# EAGLE board altair (EAGLE 9.4.1), part 1 of 2
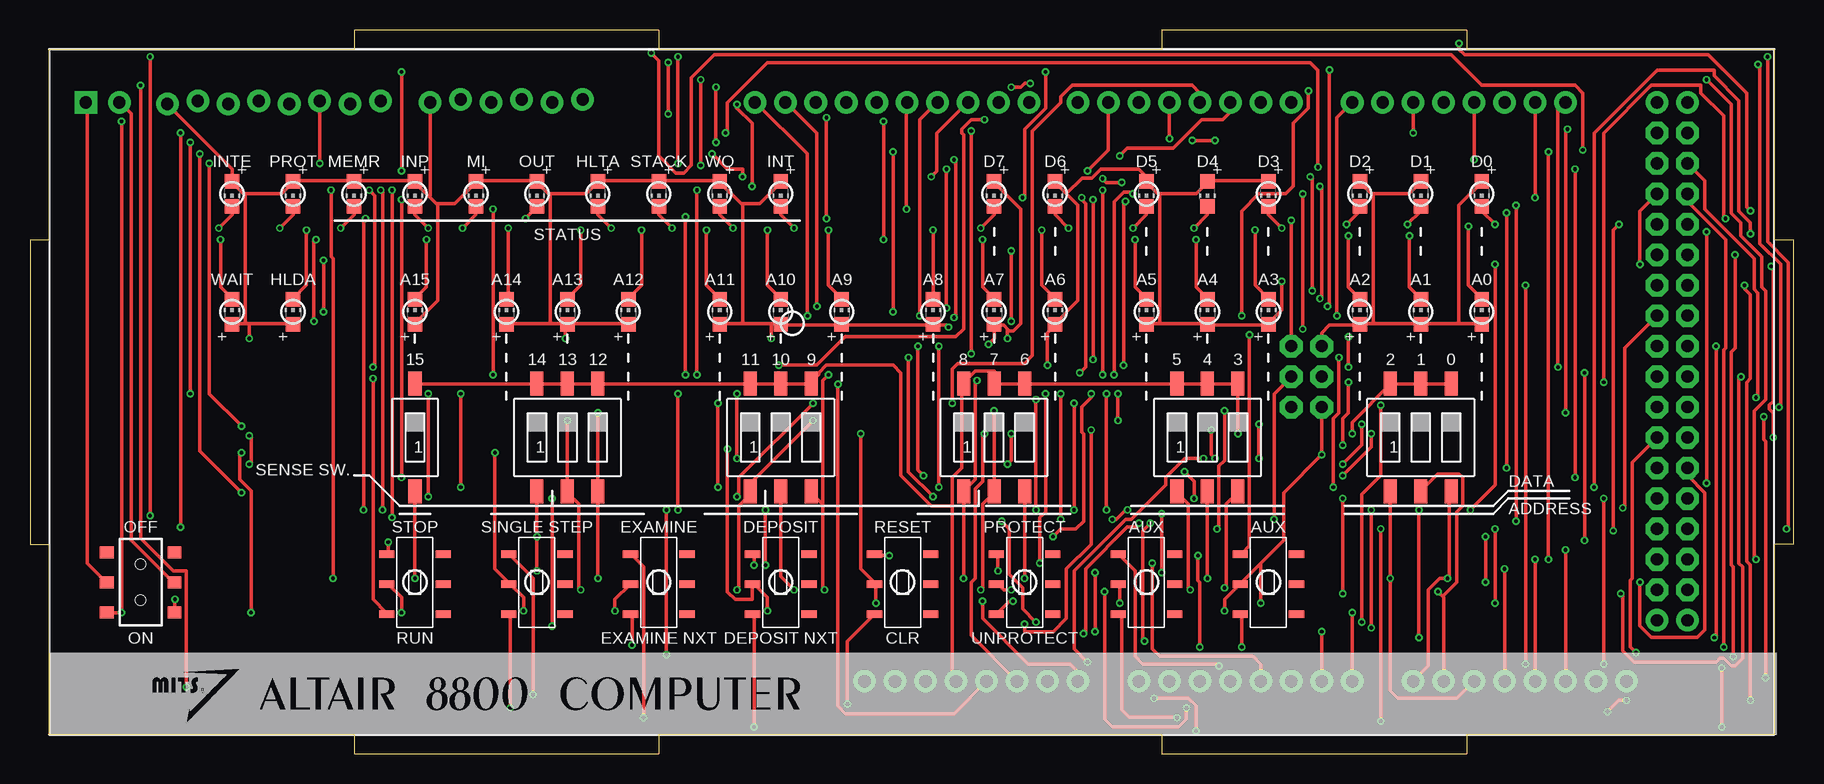
[diagram p2: board, top side]
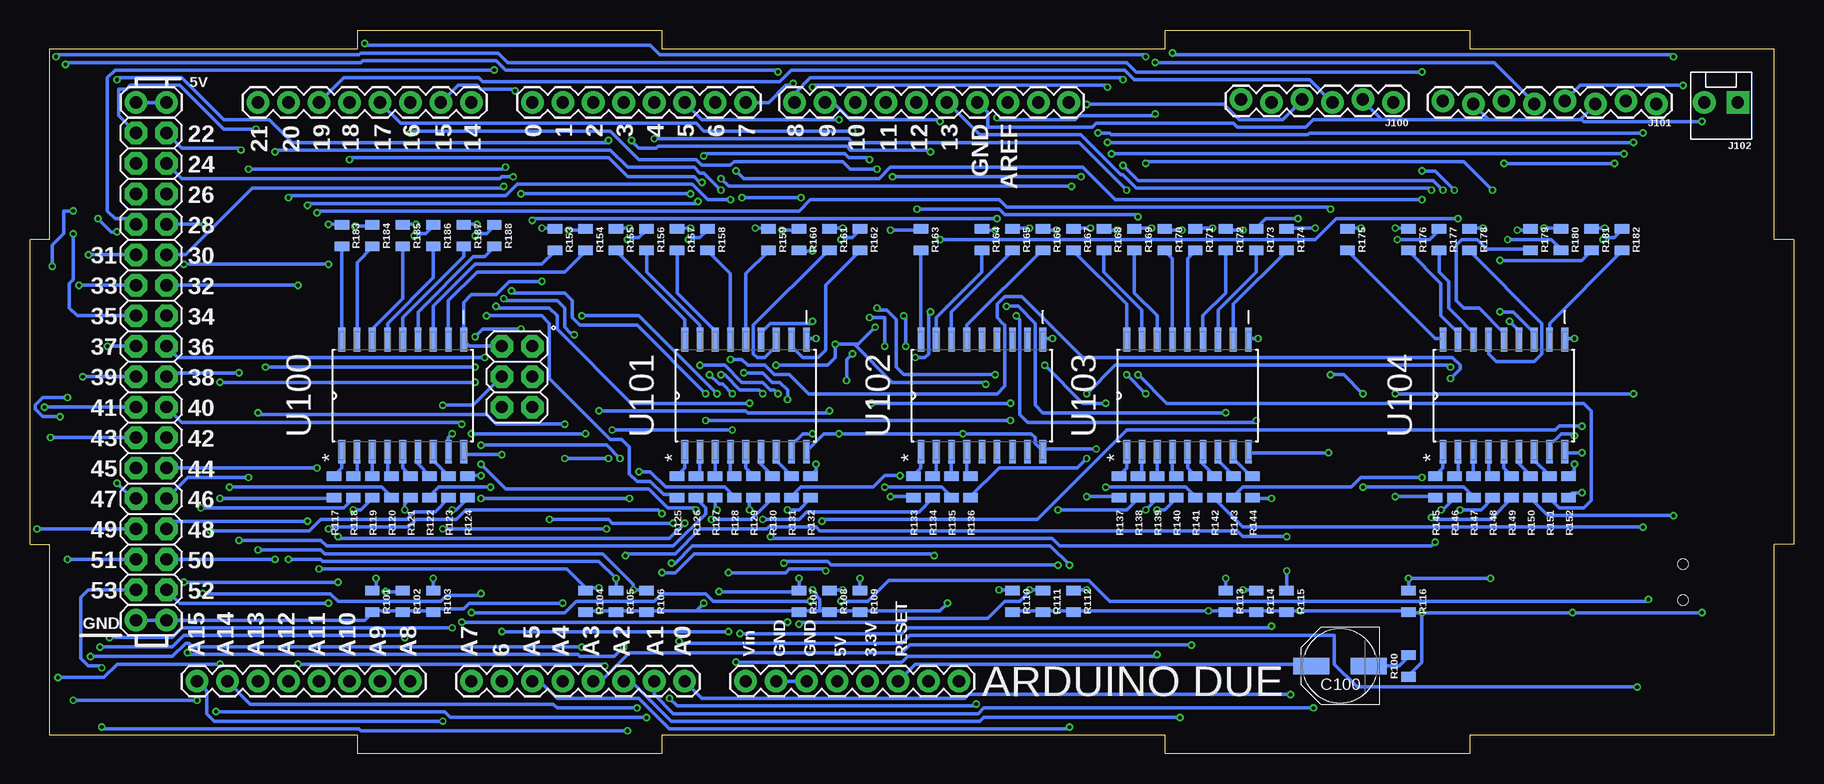
[diagram p3: board, bottom side, seen from below]

Size 146.96 x 60.35 mm. Coordinates in mm from the lower left corner, seen from the top.
Outline: 1.6,1.6 1.6,17.48 0,17.48 0,42.88 1.6,42.88 1.6,58.75 27,58.75 27,60.35 52.4,60.35 52.4,58.75 94.31,58.75 94.31,60.35 119.71,60.35 119.71,58.75 145.36,58.75 145.36,42.88 146.96,42.88 146.96,17.48 145.36,17.48 145.36,1.6 119.71,1.6 119.71,0 94.31,0 94.31,1.6 52.4,1.6 52.4,0 27,0 27,1.6 1.6,1.6
Copper layers (1*16): Top 0.035mm / dielectric 1.5mm / Bottom 0.035mm
Design rules "SeeedStudio_2layer_DRU_no_angle_20140221": minimum track width 6mil, minimum drill 12mil, track to track 6mil, track to pad 6mil, pad to pad 6mil, via to via 6mil, smd to smd 0mil, copper to edge 10mil, drill to drill 10mil, minimum pad ring 10mil, minimum via ring 6mil, stop-mask expansion 2mil, vias tented up to drill 100mil, thermal gap 10mil

## Footprints (pad centres in the part's own frame; a part is rotated, then mirrored left to right if it is on the bottom)
PANASONIC_D = smd 3 x 1.4: + 2.4,0; - -2.4,0
1X06_LOCK = drill 1.016 pad 1.88: 1 0,0; 2 2.54,-0.254; 3 5.08,0; 4 7.62,-0.254; 5 10.16,0; 6 12.7,-0.254
1X08_LOCK = drill 1.016 pad 1.88: 1 0,0.127; 2 2.54,-0.127; 3 5.08,0.127; 4 7.62,-0.127; 5 10.16,0.127; 6 12.7,-0.127; 7 15.24,0.127; 8 17.78,-0.127
MOLEX-1X2_LOCK = drill 1.016 pad 1.88 square: 1 -0.127,0 | drill 1.016 pad 1.88: 2 2.667,0
CHIP-LED0805 = smd 1.2 x 1.2: A 0,-1.05; C 0,1.05
ARDUINO_MEGA2560 = drill 1.016 pad 1.88: 0 63.5,50.8; 1 60.96,50.8; 2 58.42,50.8; 3 55.88,50.8; 3.3V 35.56,2.54; 4 53.34,50.8; 5 50.8,50.8; 5V 38.1,2.54; 5V. 93.98,50.8; 5V.. 96.52,50.8; 6 48.26,50.8; 7 45.72,50.8; 8 41.656,50.8; 9 39.116,50.8; 10 36.576,50.8; 11 34.036,50.8; 12 31.496,50.8; 13 28.956,50.8; 14 68.58,50.8; 15 71.12,50.8; 16 73.66,50.8; 17 76.2,50.8; 18 78.74,50.8; 19 81.28,50.8; 20 83.82,50.8; 21 86.36,50.8; A0 50.8,2.54; A1 53.34,2.54; A2 55.88,2.54; A3 58.42,2.54; A4 60.96,2.54; A5 63.5,2.54; A6 66.04,2.54; A7 68.58,2.54; A8 73.66,2.54; A9 76.2,2.54; A10 78.74,2.54; A11 81.28,2.54; A12 83.82,2.54; A13 86.36,2.54; A14 88.9,2.54; A15 91.44,2.54; AREF 23.876,50.8; GND 26.416,50.8; GND. 43.18,2.54; GND.. 40.64,2.54; GND... 93.98,7.62; GND.... 96.52,7.62; I/OREF 30.48,2.54; N/C 27.94,2.54; RESET 33.02,2.54; SCL1 18.796,50.8; SDA1 21.336,50.8; VIN 45.72,2.54 | drill 1.016 pad 1.88 octagon: 22 93.98,48.26; 23 96.52,48.26; 24 93.98,45.72; 25 96.52,45.72; 26 93.98,43.18; 27 96.52,43.18; 28 93.98,40.64; 29 96.52,40.64; 30 93.98,38.1; 31 96.52,38.1; 32 93.98,35.56; 33 96.52,35.56; 34 93.98,33.02; 35 96.52,33.02; 36 93.98,30.48; 37 96.52,30.48; 38 93.98,27.94; 39 96.52,27.94; 40 93.98,25.4; 41 96.52,25.4; 42 93.98,22.86; 43 96.52,22.86; 44 93.98,20.32; 45 96.52,20.32; 46 93.98,17.78; 47 96.52,17.78; 48 93.98,15.24; 49 96.52,15.24; 50 93.98,12.7; 51 96.52,12.7; 52 93.98,10.16; 53 96.52,10.16; +5V_ 66.04,30.48; GND__ 66.04,25.4; MISO 63.5,30.48; MOSI 66.04,27.94; RESET. 63.5,25.4; SCK 63.5,27.94
0805 = smd 0.8 x 1.2: 1 -0.9,0; 2 0.9,0
SMS-001 = smd 1.092 x 2.007: 1 0,-4.496; 2 0,4.496
SMS-003 = smd 1.092 x 2.007: 1 -2.54,-4.496; 2 0,-4.496; 3 2.54,-4.496; 4 2.54,4.496; 5 0,4.496; 6 -2.54,4.496
SWITCH_DPDT_SMD_AYZ0202 = smd 1 x 1.15: 1 -2.5,2.825; 2 0,2.825; 3 2.5,2.825; 4 -2.5,-2.825; 5 0,-2.825; 6 2.5,-2.825 | hole 0.85: 1.5,0; -1.5,0
K5-1640SN-01 = smd 1.27 x 0.635: P1 -2.35,2.35; P2 -2.35,-0.15; P3 -2.35,-2.65; P4 2.35,-2.65; P5 2.35,-0.15; P6 2.35,2.35
SOIC127P1030X265-18N = smd 1.981 x 0.559: 1 -4.674,5.08; 2 -4.674,3.81; 3 -4.674,2.54; 4 -4.674,1.27; 5 -4.674,0; 6 -4.674,-1.27; 7 -4.674,-2.54; 8 -4.674,-3.81; 9 -4.674,-5.08; 10 4.674,-5.08; 11 4.674,-3.81; 12 4.674,-2.54; 13 4.674,-1.27; 14 4.674,0; 15 4.674,1.27; 16 4.674,2.54; 17 4.674,3.81; 18 4.674,5.08

## Placement (x,y rotation side)
C100  [PANASONIC_D]  37.8,7.32 180 bottom
J100  [1X06_LOCK]  33.35,54.31 180 bottom
J101  [1X08_LOCK]  11.44,54.31 180 bottom
J102  [MOLEX-1X2_LOCK]  4.78,54.31 180 bottom
LED1  [CHIP-LED0805]  16.84,46.69 180 top
LED2  [CHIP-LED0805]  21.92,46.69 180 top
LED3  [CHIP-LED0805]  27,46.69 180 top
LED4  [CHIP-LED0805]  32.08,46.69 180 top
LED5  [CHIP-LED0805]  37.16,46.69 180 top
LED6  [CHIP-LED0805]  42.24,46.69 180 top
LED7  [CHIP-LED0805]  47.32,46.69 180 top
LED8  [CHIP-LED0805]  52.4,46.69 180 top
LED9  [CHIP-LED0805]  57.48,46.69 180 top
LED10  [CHIP-LED0805]  62.56,46.69 180 top
LED11  [CHIP-LED0805]  80.34,46.69 180 top
LED12  [CHIP-LED0805]  85.42,46.69 180 top
LED13  [CHIP-LED0805]  93.04,46.69 180 top
LED14  [CHIP-LED0805]  98.12,46.69 180 top
LED15  [CHIP-LED0805]  103.2,46.69 180 top
LED16  [CHIP-LED0805]  110.82,46.69 180 top
LED17  [CHIP-LED0805]  115.9,46.69 180 top
LED18  [CHIP-LED0805]  120.98,46.69 180 top
LED19  [CHIP-LED0805]  16.84,36.84 0 top
LED20  [CHIP-LED0805]  21.92,36.84 0 top
LED21  [CHIP-LED0805]  32.08,36.84 0 top
LED22  [CHIP-LED0805]  39.7,36.84 0 top
LED23  [CHIP-LED0805]  44.78,36.84 0 top
LED24  [CHIP-LED0805]  49.86,36.84 0 top
LED25  [CHIP-LED0805]  57.48,36.84 0 top
LED26  [CHIP-LED0805]  62.56,36.84 0 top
LED27  [CHIP-LED0805]  67.64,36.84 0 top
LED28  [CHIP-LED0805]  75.26,36.84 0 top
LED29  [CHIP-LED0805]  80.34,36.84 0 top
LED30  [CHIP-LED0805]  85.42,36.84 0 top
LED31  [CHIP-LED0805]  93.04,36.84 0 top
LED32  [CHIP-LED0805]  98.12,36.84 0 top
LED33  [CHIP-LED0805]  103.2,36.84 0 top
LED34  [CHIP-LED0805]  110.82,36.84 0 top
LED35  [CHIP-LED0805]  115.9,36.84 0 top
LED36  [CHIP-LED0805]  120.98,36.84 0 top
PCB1  ARDUINO_DUEARDUINO_DUE  [ARDUINO_MEGA2560]  41.61,3.51 0 top
R100  100E  [0805]  32.08,7.32 90 bottom
R101  100E  [0805]  118.44,12.71 270 bottom
R102  100E  [0805]  115.9,12.71 270 bottom
R103  100E  [0805]  113.36,12.71 270 bottom
R104  100E  [0805]  100.66,12.71 270 bottom
R105  100E  [0805]  98.12,12.71 270 bottom
R106  100E  [0805]  95.58,12.71 270 bottom
R107  100E  [0805]  82.88,12.71 270 bottom
R108  100E  [0805]  80.34,12.71 270 bottom
R109  100E  [0805]  77.8,12.71 270 bottom
R110  100E  [0805]  65.1,12.71 270 bottom
R111  100E  [0805]  62.56,12.71 270 bottom
R112  100E  [0805]  60.02,12.71 270 bottom
R113  100E  [0805]  47.32,12.71 270 bottom
R114  100E  [0805]  44.78,12.71 270 bottom
R115  100E  [0805]  42.24,12.71 270 bottom
R116  100E  [0805]  32.08,12.71 270 bottom
R117  100E  [0805]  121.62,22.24 90 bottom
R118  100E  [0805]  120.03,22.24 90 bottom
R119  100E  [0805]  118.44,22.24 90 bottom
R120  100E  [0805]  116.85,22.24 90 bottom
R121  100E  [0805]  115.27,22.24 90 bottom
R122  100E  [0805]  113.68,22.24 90 bottom
R123  100E  [0805]  112.09,22.24 90 bottom
R124  100E  [0805]  110.5,22.24 90 bottom
R125  100E  [0805]  93.04,22.24 90 bottom
R126  100E  [0805]  91.45,22.24 90 bottom
R127  100E  [0805]  89.87,22.24 90 bottom
R128  100E  [0805]  88.28,22.24 90 bottom
R129  100E  [0805]  86.69,22.24 90 bottom
R130  100E  [0805]  85.1,22.24 90 bottom
R131  100E  [0805]  83.52,22.24 90 bottom
R132  100E  [0805]  81.93,22.24 90 bottom
R133  100E  [0805]  73.36,22.24 90 bottom
R134  100E  [0805]  71.77,22.24 90 bottom
R135  100E  [0805]  70.18,22.24 90 bottom
R136  100E  [0805]  68.59,22.24 90 bottom
R137  100E  [0805]  56.21,22.24 90 bottom
R138  100E  [0805]  54.62,22.24 90 bottom
R139  100E  [0805]  53.04,22.24 90 bottom
R140  100E  [0805]  51.45,22.24 90 bottom
R141  100E  [0805]  49.86,22.24 90 bottom
R142  100E  [0805]  48.27,22.24 90 bottom
R143  100E  [0805]  46.69,22.24 90 bottom
R144  100E  [0805]  45.1,22.24 90 bottom
R145  100E  [0805]  29.86,22.24 90 bottom
R146  100E  [0805]  28.27,22.24 90 bottom
R147  100E  [0805]  26.68,22.24 90 bottom
R148  100E  [0805]  25.1,22.24 90 bottom
R149  100E  [0805]  23.51,22.24 90 bottom
R150  100E  [0805]  21.92,22.24 90 bottom
R151  100E  [0805]  20.33,22.24 90 bottom
R152  100E  [0805]  18.75,22.24 90 bottom
R153  100E  [0805]  103.2,42.88 270 bottom
R154  100E  [0805]  100.66,42.88 270 bottom
R155  100E  [0805]  98.12,42.88 90 bottom
R156  100E  [0805]  95.58,42.88 90 bottom
R157  100E  [0805]  93.04,42.88 90 bottom
R158  100E  [0805]  90.5,42.88 90 bottom
R159  100E  [0805]  85.42,42.88 90 bottom
R160  100E  [0805]  82.88,42.88 90 bottom
R161  100E  [0805]  80.34,42.88 90 bottom
R162  100E  [0805]  77.8,42.88 90 bottom
R163  100E  [0805]  72.72,42.88 90 bottom
R164  100E  [0805]  67.64,42.88 90 bottom
R165  100E  [0805]  65.1,42.88 90 bottom
R166  100E  [0805]  62.56,42.88 90 bottom
R167  100E  [0805]  60.02,42.88 90 bottom
R168  100E  [0805]  57.48,42.88 90 bottom
R169  100E  [0805]  54.94,42.88 90 bottom
R170  100E  [0805]  52.4,42.88 90 bottom
R171  100E  [0805]  49.86,42.88 90 bottom
R172  100E  [0805]  47.32,42.88 90 bottom
R173  100E  [0805]  44.78,42.88 90 bottom
R174  100E  [0805]  42.24,42.88 90 bottom
R175  100E  [0805]  37.16,42.88 90 bottom
R176  100E  [0805]  32.08,42.88 90 bottom
R177  100E  [0805]  29.54,42.88 90 bottom
R178  100E  [0805]  27,42.88 90 bottom
R179  100E  [0805]  21.92,42.88 90 bottom
R180  100E  [0805]  19.38,42.88 90 bottom
R181  100E  [0805]  16.84,42.88 90 bottom
R182  100E  [0805]  14.3,42.88 90 bottom
R183  100E  [0805]  120.98,43.19 270 bottom
R184  100E  [0805]  118.44,43.19 270 bottom
R185  100E  [0805]  115.9,43.19 270 bottom
R186  100E  [0805]  113.36,43.19 270 bottom
R187  100E  [0805]  110.82,43.19 270 bottom
R188  100E  [0805]  108.28,43.19 270 bottom
S1  SWS001  [SMS-001]  32.08,26.37 0 top
S2  SWS003  [SMS-003]  44.78,26.37 0 top
S3  SWS003  [SMS-003]  62.56,26.37 0 top
S4  SWS003  [SMS-003]  80.34,26.37 0 top
S5  SWS003  [SMS-003]  98.12,26.37 0 top
S6  SWS003  [SMS-003]  115.9,26.37 0 top
S7  [SWITCH_DPDT_SMD_AYZ0202]  9.22,14.3 270 top
S8  K5-1640SN-01  [K5-1640SN-01]  32.08,14.3 0 top
S9  K5-1640SN-01  [K5-1640SN-01]  42.24,14.3 0 top
S10  K5-1640SN-01  [K5-1640SN-01]  52.4,14.3 0 top
S11  K5-1640SN-01  [K5-1640SN-01]  62.56,14.3 0 top
S12  K5-1640SN-01  [K5-1640SN-01]  72.72,14.3 0 top
S13  K5-1640SN-01  [K5-1640SN-01]  82.88,14.3 0 top
S14  K5-1640SN-01  [K5-1640SN-01]  93.04,14.3 0 top
S15  K5-1640SN-01  [K5-1640SN-01]  103.2,14.3 0 top
U100  ULN2803ADW  [SOIC127P1030X265-18N]  115.9,29.86 90 bottom
U101  ULN2803ADW  [SOIC127P1030X265-18N]  87.33,29.86 90 bottom
U102  ULN2803ADW  [SOIC127P1030X265-18N]  67.64,29.86 90 bottom
U103  ULN2803ADW  [SOIC127P1030X265-18N]  50.5,29.86 90 bottom
U104  ULN2803ADW  [SOIC127P1030X265-18N]  24.14,29.86 90 bottom